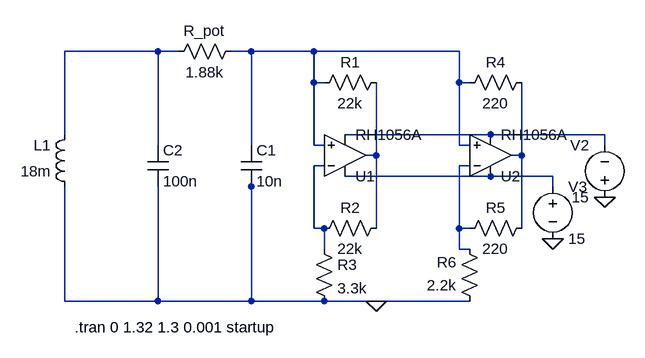
[diagram p0: schematic ChuaCicruit.asc]
ChuaCicruit.asc, the LTspice schematic file:
Version 4
SHEET 1 880 680
WIRE -160 -16 -304 -16
WIRE -128 -16 -160 -16
WIRE -16 -16 -48 -16
WIRE 80 -16 -16 -16
WIRE 304 -16 80 -16
WIRE 80 32 80 -16
WIRE 96 32 80 32
WIRE 304 32 304 -16
WIRE 320 32 304 32
WIRE -304 112 -304 -16
WIRE 352 112 128 112
WIRE 528 112 352 112
WIRE -160 128 -160 -16
WIRE -16 128 -16 -16
WIRE 80 128 80 32
WIRE 96 128 80 128
WIRE 304 128 304 32
WIRE 320 128 304 128
WIRE 528 128 528 112
WIRE 176 144 176 32
WIRE 176 144 160 144
WIRE 400 144 400 32
WIRE 400 144 384 144
WIRE 96 160 80 160
WIRE 320 160 304 160
WIRE 352 176 128 176
WIRE 448 176 352 176
WIRE -16 192 -16 176
WIRE 448 192 448 176
WIRE 80 256 80 160
WIRE 96 256 80 256
WIRE 176 256 176 144
WIRE 304 256 304 160
WIRE 320 256 304 256
WIRE 400 256 400 144
WIRE 96 288 96 256
WIRE 304 288 304 256
WIRE 320 288 304 288
WIRE -304 368 -304 192
WIRE -160 368 -160 192
WIRE -160 368 -304 368
WIRE -16 368 -16 192
WIRE -16 368 -160 368
WIRE 96 368 -16 368
WIRE 176 368 96 368
WIRE 320 368 176 368
FLAG 176 368 0
FLAG 448 272 0
FLAG 528 208 0
SYMBOL Opamps\\RH1056A 128 208 M180
SYMATTR InstName U1
SYMBOL Opamps\\RH1056A 352 208 M180
SYMATTR InstName U2
SYMBOL res 192 16 R90
WINDOW 0 0 56 VBottom 2
WINDOW 3 32 56 VTop 2
SYMATTR InstName R1
SYMATTR Value 22k
SYMBOL res 192 240 R90
WINDOW 0 0 56 VBottom 2
WINDOW 3 32 56 VTop 2
SYMATTR InstName R2
SYMATTR Value 22k
SYMBOL res 80 272 R0
SYMATTR InstName R3
SYMATTR Value 3.3k
SYMBOL res 416 16 R90
WINDOW 0 0 56 VBottom 2
WINDOW 3 32 56 VTop 2
SYMATTR InstName R4
SYMATTR Value 220
SYMBOL res 416 240 R90
WINDOW 0 0 56 VBottom 2
WINDOW 3 32 56 VTop 2
SYMATTR InstName R5
SYMATTR Value 220
SYMBOL res 336 384 R180
WINDOW 0 36 76 Left 2
WINDOW 3 36 40 Left 2
SYMATTR InstName R6
SYMATTR Value 2.2k
SYMBOL voltage 528 224 R180
WINDOW 0 24 96 Left 2
WINDOW 3 24 16 Left 2
WINDOW 123 0 0 Left 0
WINDOW 39 0 0 Left 0
SYMATTR InstName V2
SYMATTR Value 15
SYMBOL voltage 448 176 R0
WINDOW 123 0 0 Left 0
WINDOW 39 0 0 Left 0
SYMATTR InstName V3
SYMATTR Value 15
SYMBOL cap -32 128 R0
SYMATTR InstName C1
SYMATTR Value 10n
SYMBOL cap -176 128 R0
SYMATTR InstName C2
SYMATTR Value 100n
SYMBOL ind -288 208 R180
WINDOW 0 36 80 Left 2
WINDOW 3 36 40 Left 2
SYMATTR InstName L1
SYMATTR Value 18m
SYMBOL res -32 -32 R90
WINDOW 0 0 56 VBottom 2
WINDOW 3 32 56 VTop 2
SYMATTR InstName R_pot
SYMATTR Value 1.88k
TEXT -288 408 Left 2 !.tran 0 1.32 1.3 0.001 startup

The netlist it stands for:
* ChuaCicruit.asc
XU1 N002 N006 N008 N003 N004 RH1056A  ; pins In+ In- V+ V- OUT
XU2 N002 N007 N008 N003 N005 RH1056A  ; pins In+ In- V+ V- OUT
R1 N004 N002 22k
R2 N004 N006 22k
R3 N006 0 3.3k
R4 N005 N002 220
R5 N005 N007 220
R6 0 N007 2.2k
V2 0 N003 15
V3 N008 0 15
C1 N002 0 10n
C2 N001 0 100n
L1 0 N001 18m
R_pot N002 N001 1.88k
.tran 0 1.32 1.3 0.001 startup
.backanno
.end